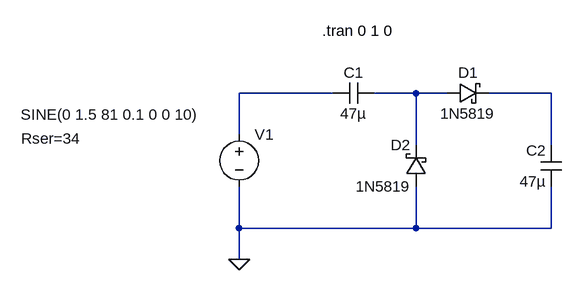
[diagram p0: schematic doubler.asc]
doubler.asc, the LTspice schematic file:
Version 4
SHEET 1 880 680
WIRE 192 64 48 64
WIRE 320 64 256 64
WIRE 368 64 320 64
WIRE 528 64 432 64
WIRE 48 128 48 64
WIRE 320 144 320 64
WIRE 528 144 528 64
WIRE 48 272 48 208
WIRE 320 272 320 208
WIRE 320 272 48 272
WIRE 528 272 528 208
WIRE 528 272 320 272
WIRE 48 320 48 272
FLAG 48 320 0
SYMBOL voltage 48 112 R0
WINDOW 3 -336 -15 Left 2
WINDOW 123 0 0 Left 2
WINDOW 39 -335 22 Left 2
SYMATTR InstName V1
SYMATTR Value SINE(0 1.5 81 0.1 0 0 10)
SYMATTR SpiceLine Rser=34
SYMBOL cap 256 48 R90
WINDOW 0 0 32 VBottom 2
WINDOW 3 32 32 VTop 2
SYMATTR InstName C1
SYMATTR Value 47µ
SYMBOL cap 544 208 R180
WINDOW 0 24 56 Left 2
WINDOW 3 24 8 Left 2
SYMATTR InstName C2
SYMATTR Value 47µ
SYMBOL schottky 368 80 R270
WINDOW 0 32 32 VTop 2
WINDOW 3 0 32 VBottom 2
SYMATTR InstName D1
SYMATTR Value 1N5819
SYMATTR Description Diode
SYMATTR Type diode
SYMBOL schottky 336 208 R180
WINDOW 0 24 64 Left 2
WINDOW 3 24 0 Left 2
SYMATTR InstName D2
SYMATTR Value 1N5819
SYMATTR Description Diode
SYMATTR Type diode
TEXT 176 -32 Left 2 !.tran 0 1 0

The netlist it stands for:
* doubler.asc
V1 N001 0 SINE(0 1.5 81 0.1 0 0 10) Rser=34
C1 N002 N001 47µ
C2 0 N003 47µ
D1 N002 N003 1N5819
D2 0 N002 1N5819
.model D D
.lib standard.dio
.tran 0 1 0
.backanno
.end